# EAGLE design untitled (EAGLE 5.06)
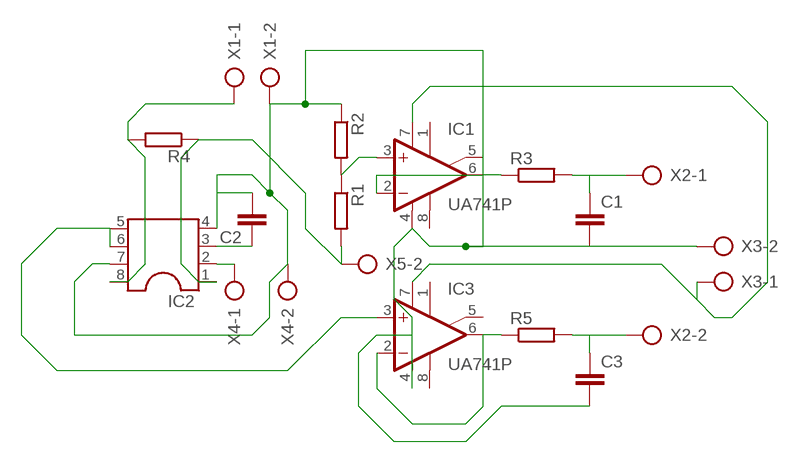
[diagram p0: schematic, sheet 1]

## Parts
C1  C-EU025-025X050  [C025-025X050]
C2  C2.5/2  [C2.5-2]
C3  C-EU025-025X050  [C025-025X050]
IC1  UA741P  [DIL08]
IC2  DIL8  [DIL08]
IC3  UA741P  [DIL08]
R1  R-EU_0207/10  [0207/10]
R2  R-EU_0207/10  [0207/10]
R3  R-EU_0207/10  [0207/10]
R4  R-EU_0207/10  [0207/10]
R5  R-EU_0207/10  [0207/10]
X1  AK300/2  [AK300/2]
X2  AK500/2-H  [AK500/2-H]
X3  AK300/2  [AK300/2]
X4  AK300/2  [AK300/2]
X5  AK300/2  [AK300/2]

## Nets
N$1: IC1.7(V+) IC3.7(V+) X3.1
N$2: IC2.8 R4.2 X1.1
N$3: IC2.1 R1.2 R4.1 X5.2
N$4: IC1.3(+IN) R1.1 R2.2
N$5: IC1.2(-IN) IC1.6(OUT) R3.1
N$6: IC3.2(-IN) IC3.6(OUT) R5.1
N$8: IC2.2 X4.1
N$9: IC2.5 IC2.6 IC3.3(+IN)
N$10: C2.1 IC2.3
N$12: C1.1 R3.2 X2.1
N$13: C3.1 R5.2 X2.2
N$16: C1.2 C2.2 C3.2 IC1.4(V-) IC2.4 IC2.7 IC3.4(V-) R2.1 X1.2 X3.2 X4.2
Unconnected: IC1.1(ON1) IC1.5(ON2) IC1.8(OPT) IC3.1(ON1) IC3.5(ON2) IC3.8(OPT) X5.1

## Library data of the parts
C1 C3 = rcl:C-EU: CAPACITOR, European symbol
C2 = capacitor-wima:C: CAPACITOR naming: grid - package width
IC1 IC3 = linear:*741: OP AMP
IC2 = ic-package:DIL8: Dual In Line / Socket
R1-R5 = resistor:R-EU_: RESISTOR, European symbol
X1 X3-X5 = con-ptr500:AK300/2: CONNECTOR
X2 = con-ptr500:AK500/2-H: CONNECTOR Aug. 2004 / PTR Meßtechnik: Die Bezeichnung der Serie AK505 wurde geändert. Es handelt sich hierbei um AK500 in horizontaler Ausführung.

## Board
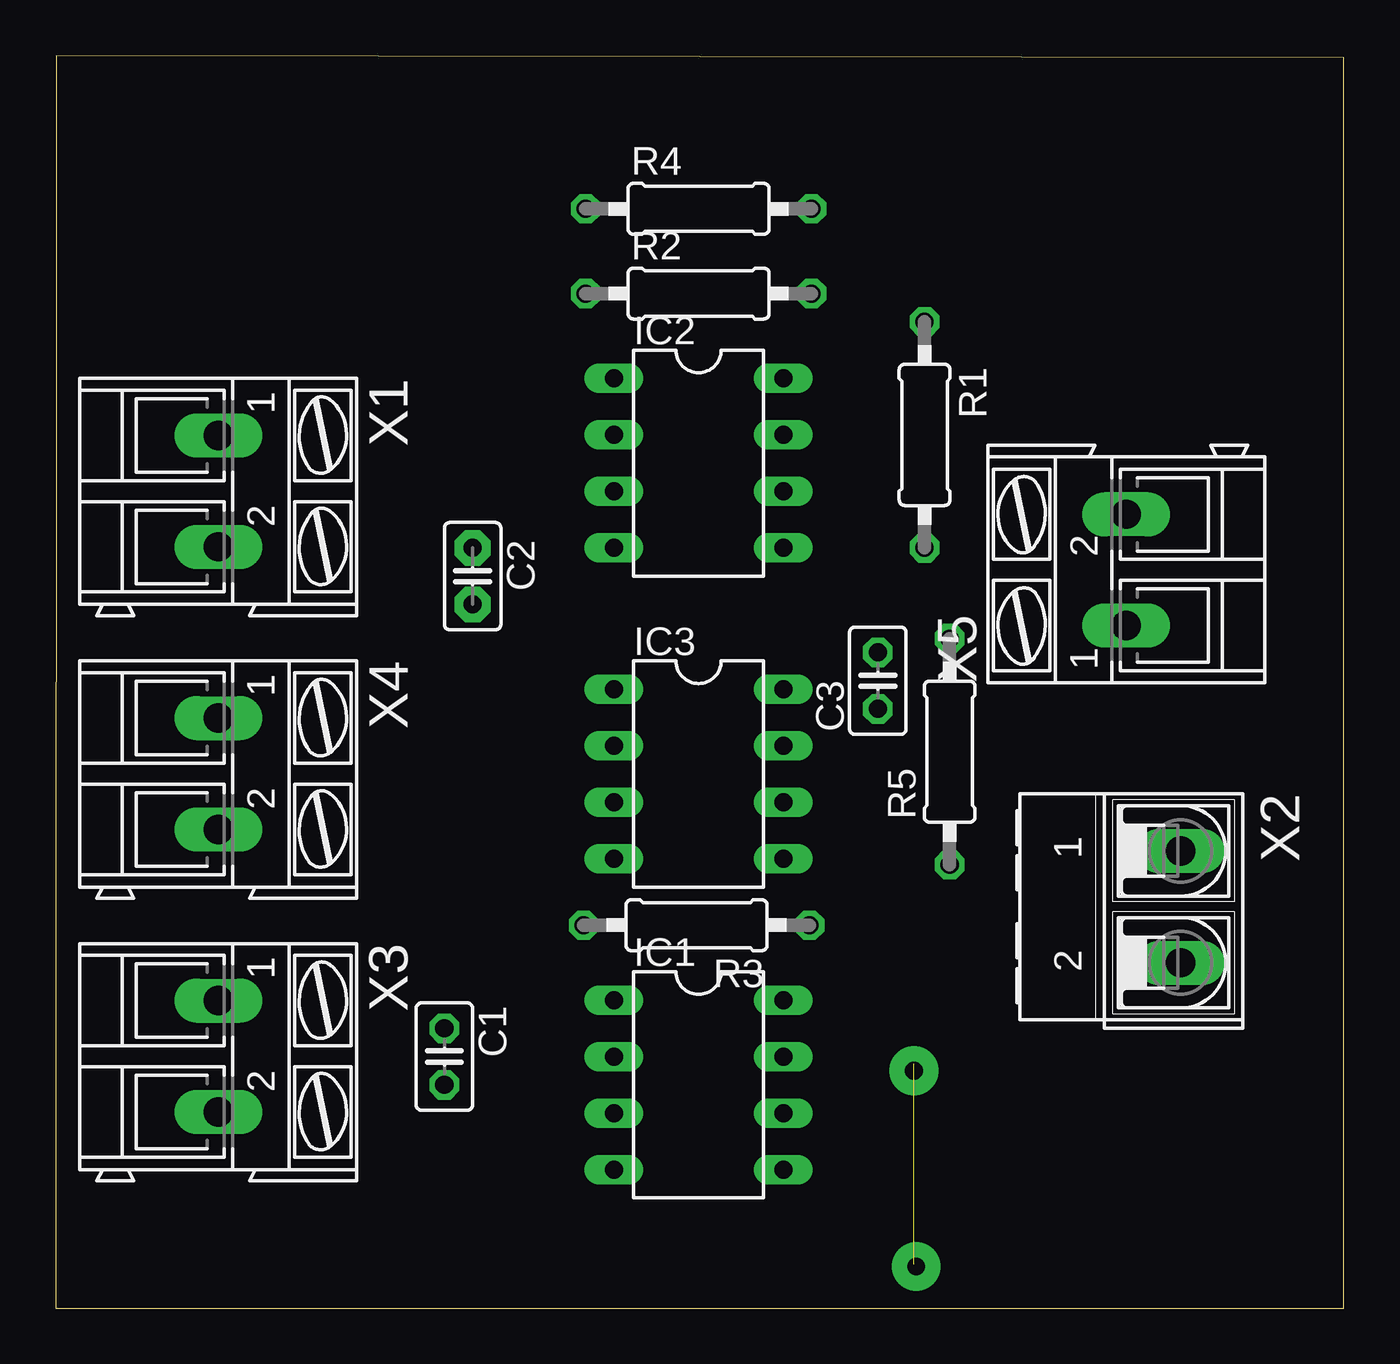
[diagram p1: board, top side]
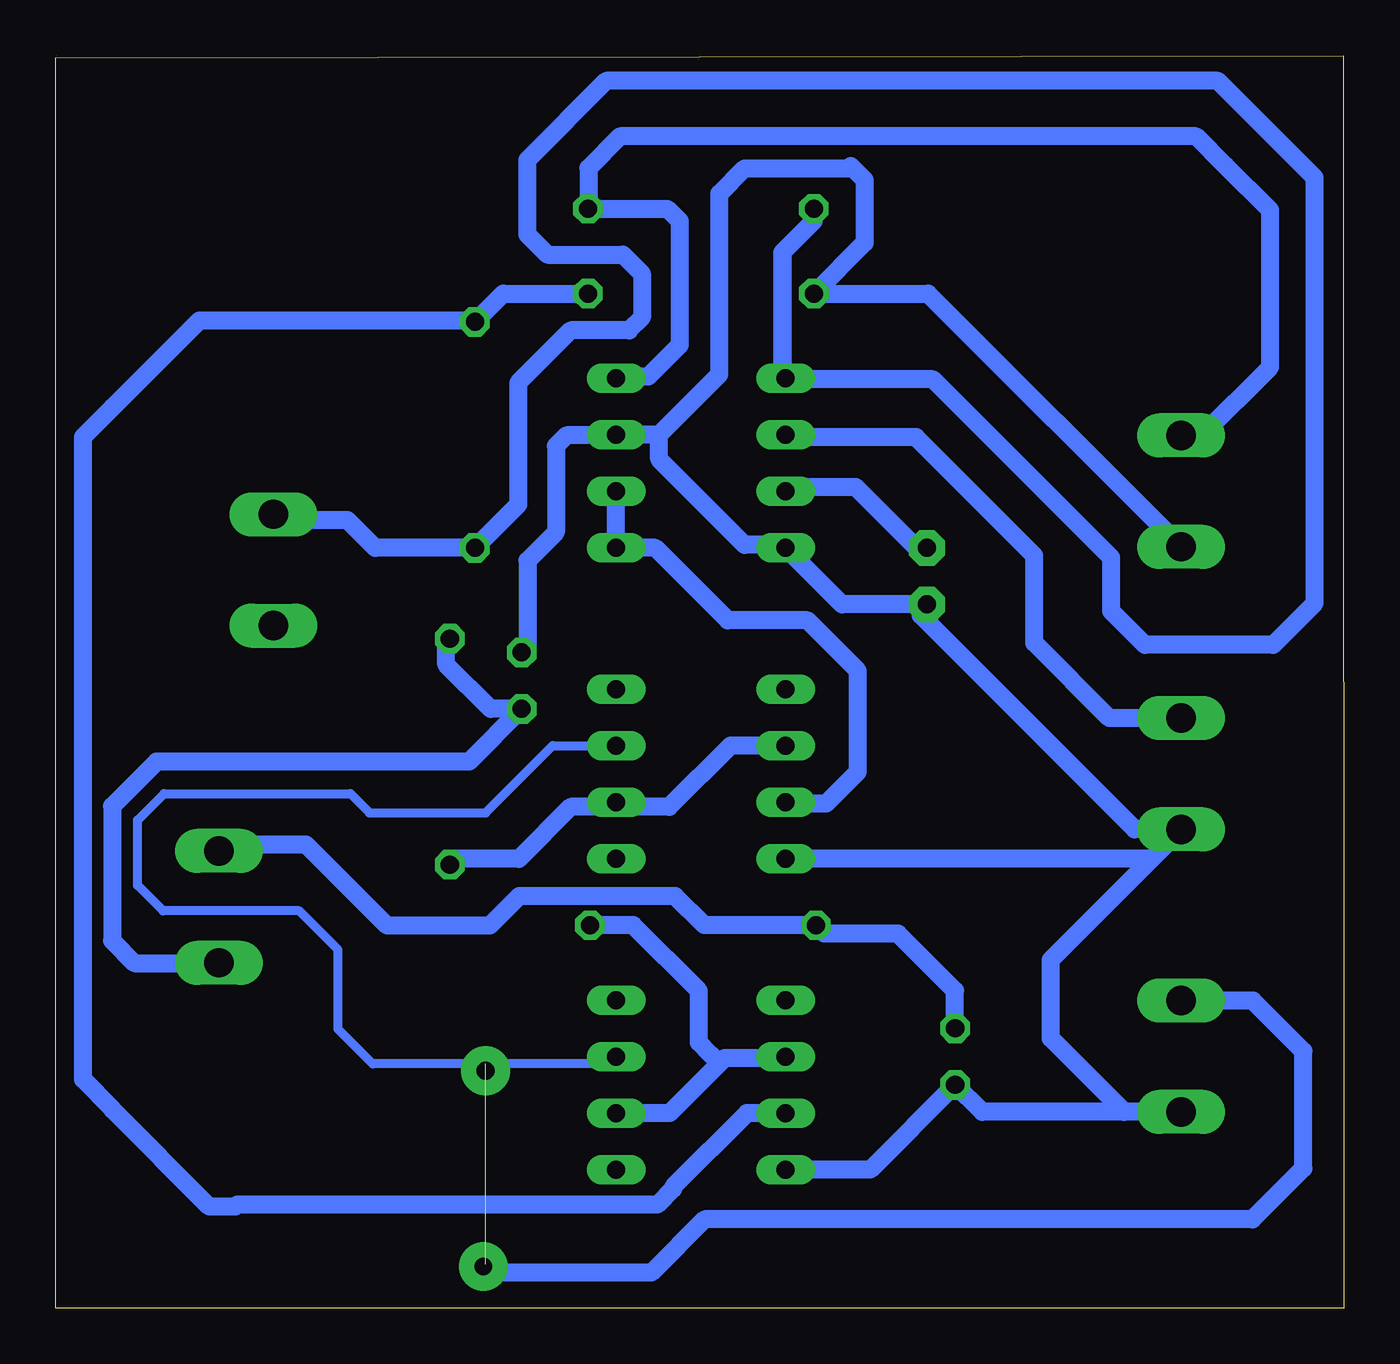
[diagram p2: board, bottom side, seen from below]

Size 57.92 x 56.29 mm. Coordinates in mm from the lower left corner, seen from the top.
Outline: 0,0 57.91,0 57.92,56.19 0.02,56.29 0,0
Copper layers (1*16): Top 0.035mm / dielectric 1.5mm / Bottom 0.035mm
Design rules "default": minimum track width 10mil, minimum drill 24mil, track to track 8mil, track to pad 8mil, pad to pad 8mil, via to via 8mil, smd to smd 8mil, copper to edge 40mil, drill to drill 8mil, minimum pad ring 10mil, minimum via ring 8mil, stop-mask expansion 4mil, vias tented up to drill 0mil, thermal gap 10mil

### Footprints (pad centres in the part's own frame; a part is rotated, then mirrored left to right if it is on the bottom)
C025-025X050 = drill 0.813 octagon: 1 -1.27,0; 2 1.27,0
C2.5-2 = drill 0.813 pad 1.6 octagon: 1 -1.27,0; 2 1.27,0
DIL08 = drill 0.813 long: 1 -3.81,-3.81; 2 -1.27,-3.81; 3 1.27,-3.81; 4 3.81,-3.81; 5 3.81,3.81; 6 1.27,3.81; 7 -1.27,3.81; 8 -3.81,3.81
0207/10 = drill 0.813 octagon: 1 -5.08,0; 2 5.08,0
AK300/2 = drill 1.321 long: 1 -2.515,0; 2 2.489,0
AK500/2-H = drill 1.321 long: 1 -2.515,0; 2 2.515,0

### Placement (x,y rotation side)
C1  17.48,11.31 270 top
C2  18.75,32.9 270 top
C3  36.97,28.2 90 top
IC1  28.91,10.04 270 top
IC2  28.91,37.98 270 top
IC3  28.91,24.01 270 top
R1  39.07,39.25 270 top
R2  28.91,45.6 0 top
R3  28.82,17.21 180 top
R4  28.91,49.41 0 top
R5  40.19,25.01 90 top
X1  7.32,36.71 270 top
X2  50.58,18.04 270 top
X3  7.32,11.31 270 top
X4  7.32,24.01 270 top
X5  48.13,33.19 90 top

### Tracks (layer width: path | path; a pad name or v marks a point on that pad's centre or on a via)
N$1  (1 unrouted)
  Bottom 0.406: IC3.7 35.57,25.28 38.58,22.26 43.8,22.26 44.66,23.12 53.05,23.12 54.23,21.93 54.23,19 53.08,17.85 46.96,17.85 45.22,16.1 45.22,12.54 43.66,10.98 33.04,10.98 IC1.7
  Bottom 0.813: X3.1 4.09,13.82 1.82,11.55 1.82,6.28 4.11,3.99 28.74,3.99 31.13,1.6 38.2,1.6 38.58,1.98
N$2
  Bottom 0.813: X1.1 6.39,39.22 3.32,42.29 3.32,49.34 5.33,51.35 6.64,52.66 32.55,52.66 33.97,51.24 33.97,49.42 R4.2 30.41,49.41 29.86,48.86 29.86,43.28 31.28,41.87 32.64,41.87 IC2.8
N$3
  Bottom 0.813: X5.2 47.87,35.41 44.79,35.41 43.55,34.17 R1.2 37.13,36.11 37.13,41.58 34.76,43.95 32.13,43.95 31.56,44.51 31.56,46.5 32.41,47.35 35.81,47.35 36.72,48.26 36.72,51.59 33.16,55.15 5.66,55.15 1.32,50.8 1.32,31.68 3.18,29.81 8.95,29.81 10.46,31.32 10.46,33.72 18.47,41.74 25.25,41.74 25.24,41.74 25.24,47.44 | R4.1 23.83,48.86 25.24,47.44 | 25.24,47.44 25.24,41.93 IC2.1
N$4
  Bottom 0.813: R2.2 37.8,45.6 R1.1 39.13,44.39 51.45,44.39 53.82,42.02 | IC1.3 26.84,8.77 30.15,5.45 30.15,5.36 30.86,4.65 49.75,4.65 49.84,4.56 51,4.56 55.35,8.91 55.35,8.95 56.68,10.28 56.68,39.16 53.82,42.02 | 53.82,42.02 55.35,40.49
N$5
  Bottom 0.813: IC1.6 30.31,8.77 28.07,11.01 | 28.07,11.01 27.85,11.23 25.17,11.23 IC1.2 | R3.1 31.96,17.21 29,14.25 29,11.94 28.47,11.41 | 28.47,11.41 | 28.07,11.01 28.47,11.41
N$6
  Bottom 0.813: IC3.2 27.58,25.28 30.33,22.52 32.5,22.52 IC3.6 32.93,22.52 34.77,22.52 37.09,20.2 39.93,20.2 R5.1
N$7  (via drill 0.8 pad 2.18)
  other vias: 38.69,1.87
N$8
  Bottom 0.813: X4.1 10.54,26.52 13.92,29.9 13.92,33.82 19.24,39.15 25,39.15 IC2.2
N$9
  Bottom 0.813: IC2.6 IC2.5 30.96,34.17 27.7,30.9 24.12,30.9 21.85,28.64 21.85,24.1 23.26,22.68 25.04,22.68 IC3.3
N$10
  Bottom 0.813: C2.1 19.22,34.17 21.94,36.89 24.91,36.89 IC2.3
N$11  (via drill 0.8 pad 2.18)
  other vias: 38.59,10.67
N$12
  Bottom 0.813: C1.1 17.48,14.27 20.04,16.83 23.36,16.83 R3.2 28.75,17.21 30.06,18.52 37.07,18.52 38.4,17.19 43.01,17.19 46.66,20.83 50.3,20.83 X2.1
N$13
  Bottom 0.813: R5.2 40.36,29.92 40.36,28.92 38.36,26.93 C3.1 39.33,24.57 53.38,24.57 55.38,22.56 55.38,16.51 54.38,15.51 51.3,15.51 51.29,15.52 X2.2
N$16
  Bottom 0.813: X1.2 18.7,45.6 R2.1 21.55,47.88 21.55,50.7 22.17,51.33 22.27,51.22 26.94,51.22 28.07,50.09 28.07,41.96 30.79,39.25 | X4.2 9.41,21.52 19.02,31.13 19.02,31.35 C2.2 22.56,31.63 IC2.4 25.24,34.31 26.94,34.31 30.79,38.15 30.79,39.25 | IC3.4 8.64,20.2 X4.2 | IC1.4 21.29,6.23 C1.2 16.26,8.82 X3.2 9.88,8.82 13.18,12.12 13.18,15.65 X4.2 | C3.2 36.71,29.72 36.71,33.59 35.43,34.87 35.43,38.75 34.96,39.22 32.74,39.22 IC2.7 30.79,39.25